# EAGLE design linesensor (EAGLE 6.4)
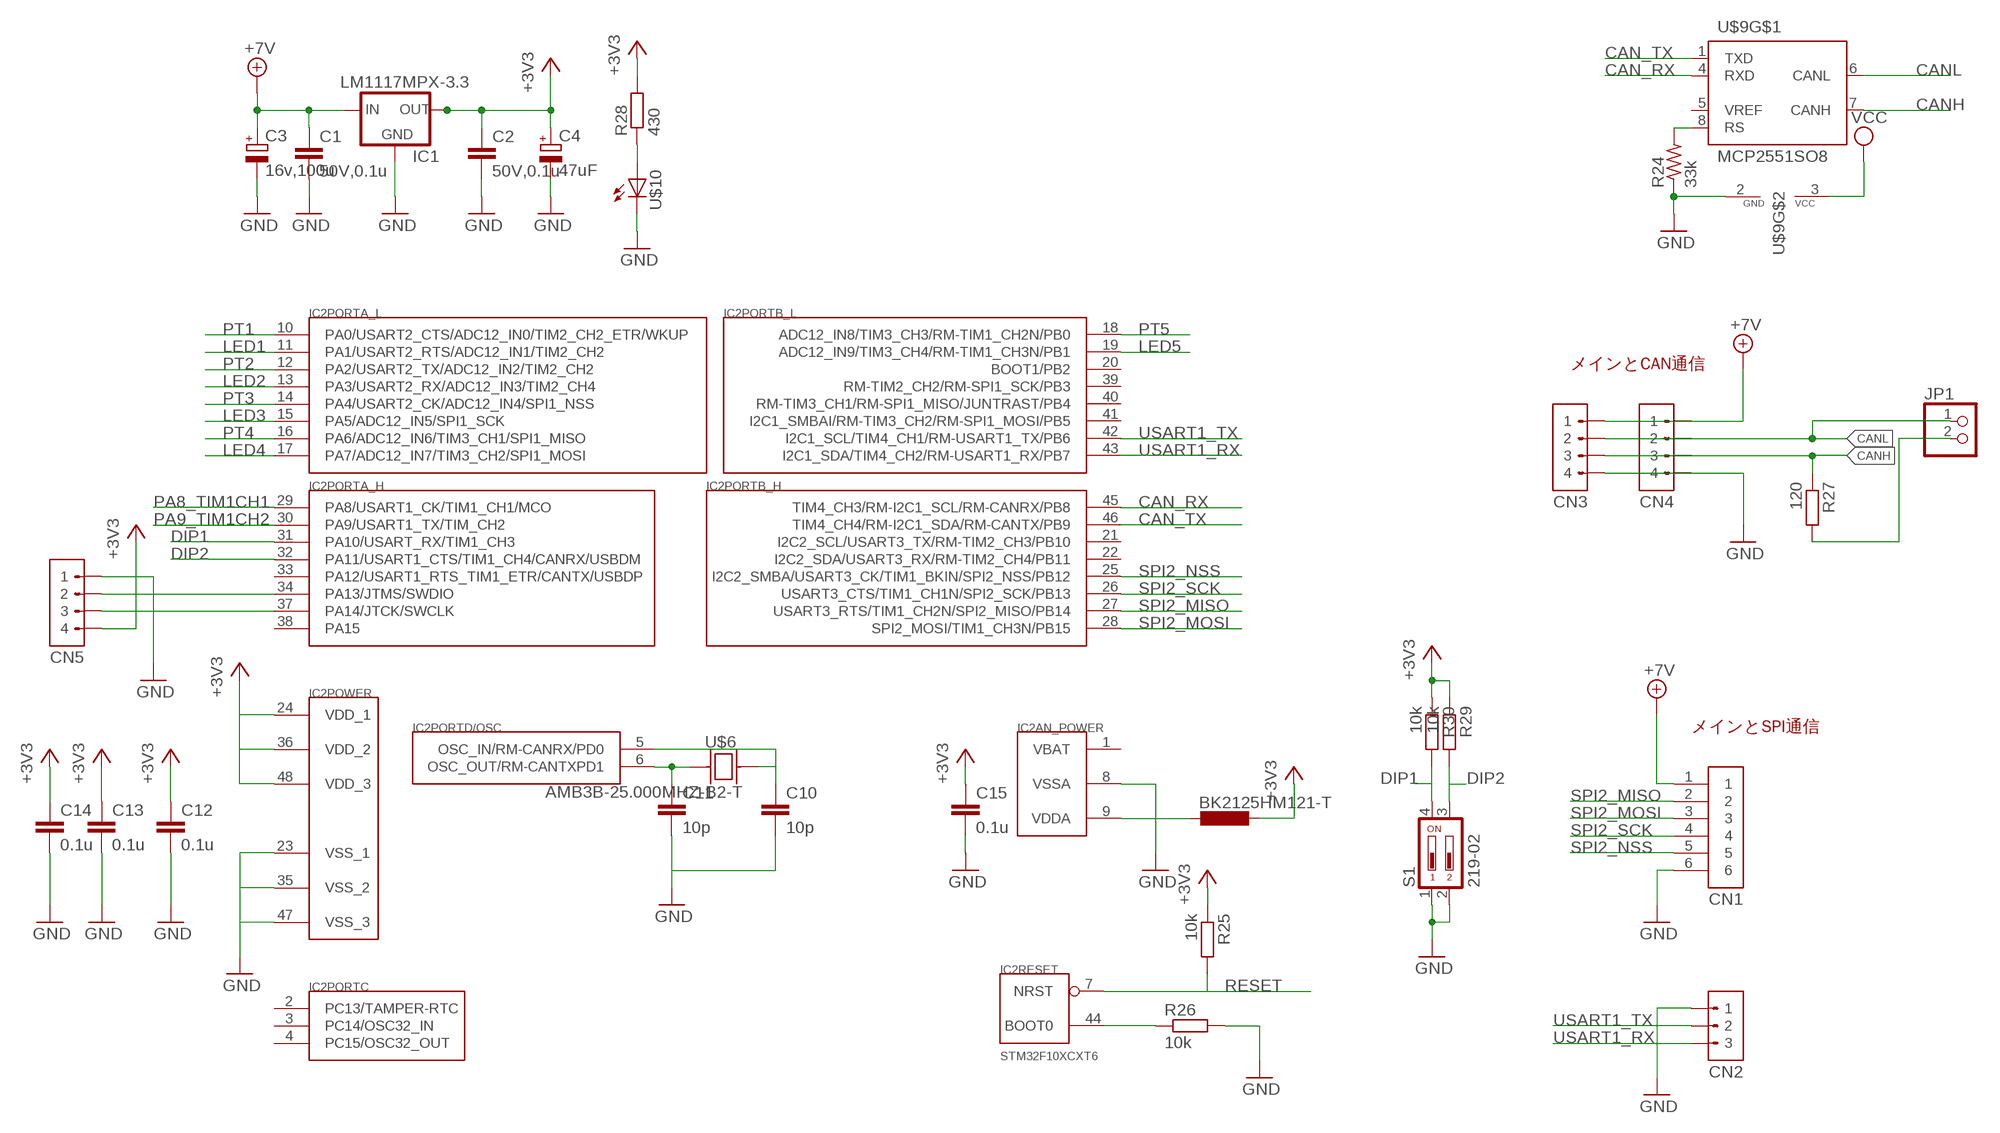
[diagram p0: schematic, sheet 1, part 1 of 2]
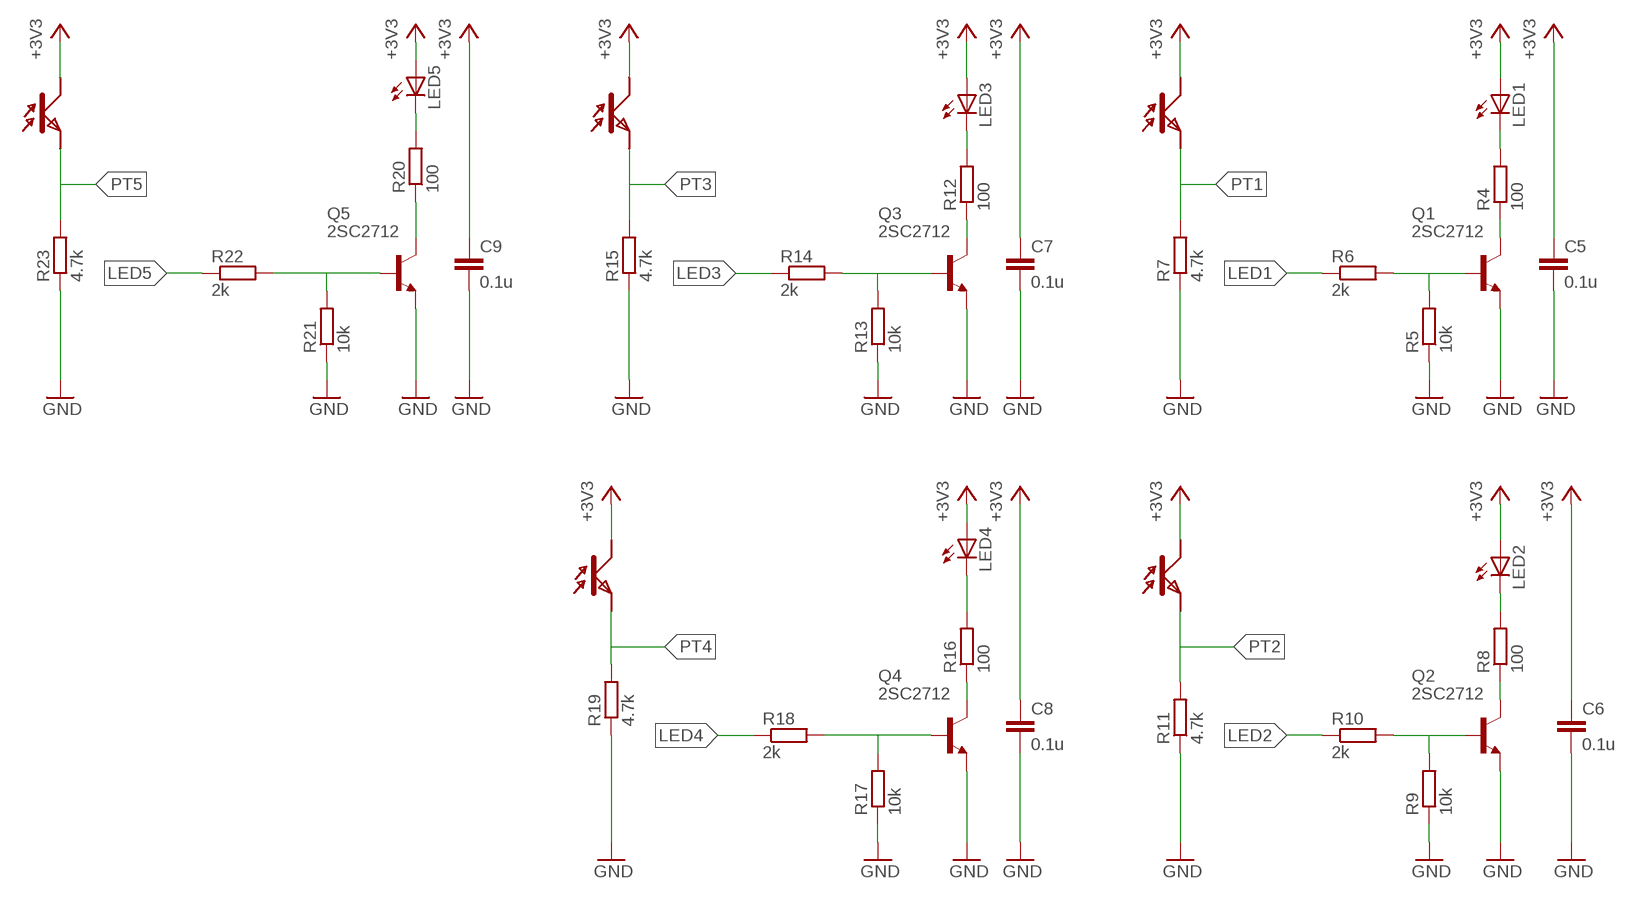
[diagram p1: schematic, sheet 1, part 2 of 2]

## Parts
BK2125HM121-T  L-EUL2012C  [L2012C]
C1  50V,0.1u  C-EUC0603K  [C0603K]
C2  50V,0.1u  C-EUC0603K  [C0603K]
C3  16v,100u  CPOL-EU153CLV-0605  [153CLV-0605]
C4  47uF  CPOL-EU153CLV-0405  [153CLV-0405]
C5  0.1u  C-EUC0603K  [C0603K]
C6  0.1u  C-EUC0603K  [C0603K]
C7  0.1u  C-EUC0603K  [C0603K]
C8  0.1u  C-EUC0603K  [C0603K]
C9  0.1u  C-EUC0603K  [C0603K]
C10  10p  C-EUC0603K  [C0603K]
C11  10p  C-EUC0603K  [C0603K]
C12  0.1u  C-EUC0603K  [C0603K]
C13  0.1u  C-EUC0603K  [C0603K]
C14  0.1u  C-EUC0603K  [C0603K]
C15  0.1u  C-EUC0603K  [C0603K]
CN1  CN6  [JST-B6B-XH-A]
CN2  TOP_TYPE_3PIN  [TOP_TYPE_3PIN]
CN3  CN4-JST-XH-TOP  [JST-B4B-XH-A]
CN4  CN4-JST-XH-TOP  [JST-B4B-XH-A]
CN5  TOP_TYPE_4PIN  [TOP_TYPE_4PIN]
IC1  LM1117MPX-3.3  LM1117  [SOT223]
IC2  STM32F10XCXT6  [TQFP48]
JP1  PINHD-1X2  [1X02]
LED1  LED3MM  [LED3MM]
LED2  LED3MM  [LED3MM]
LED3  LED3MM  [LED3MM]
LED4  LED3MM  [LED3MM]
LED5  LED3MM  [LED3MM]
Q1  2SC2712  [SC-59(TYPE1)]
Q2  2SC2712  [SC-59(TYPE1)]
Q3  2SC2712  [SC-59(TYPE1)]
Q4  2SC2712  [SC-59(TYPE1)]
Q5  2SC2712  [SC-59(TYPE1)]
R4  100  R-EU_R0603  [R0603]
R5  10k  R-EU_R0603  [R0603]
R6  2k  R-EU_R0603  [R0603]
R7  4.7k  R-EU_R0603  [R0603]
R8  100  R-EU_R0603  [R0603]
R9  10k  R-EU_R0603  [R0603]
R10  2k  R-EU_R0603  [R0603]
R11  4.7k  R-EU_R0603  [R0603]
R12  100  R-EU_R0603  [R0603]
R13  10k  R-EU_R0603  [R0603]
R14  2k  R-EU_R0603  [R0603]
R15  4.7k  R-EU_R0603  [R0603]
R16  100  R-EU_R0603  [R0603]
R17  10k  R-EU_R0603  [R0603]
R18  2k  R-EU_R0603  [R0603]
R19  4.7k  R-EU_R0603  [R0603]
R20  100  R-EU_R0603  [R0603]
R21  10k  R-EU_R0603  [R0603]
R22  2k  R-EU_R0603  [R0603]
R23  4.7k  R-EU_R0603  [R0603]
R24  33k  R-US_R0603  [R0603]
R25  10k  R-EU_R0603  [R0603]
R26  10k  R-EU_R0603  [R0603]
R27  120  R-EU_R0603  [R0603]
R28  430  R-EU_R0603  [R0603]
R29  10k  R-EU_R0603  [R0603]
R30  10k  R-EU_R0603  [R0603]
S1  219-02  [CTS-219-02]
U$1  SFH213  [SFH213]
U$2  SFH213  [SFH213]
U$3  SFH213  [SFH213]
U$4  SFH213  [SFH213]
U$5  SFH213  [SFH213]
U$6  AMB3B-25.000MHZ-B2-T  [4LCC]
U$9  MCP2551SO8  [SO08]
U$10  0603  [0603]

## Nets
+3V3: BK2125HM121-T.1 C2.1 C4.+ C5.1 C6.1 C7.1 C8.1 C9.1 C12.1 C13.1 C14.1 C15.1 CN5.4 IC1.2(OUT1) IC1.4(OUT) IC2.24(POWER:VDD_1) IC2.36(POWER:VDD_2) IC2.48(POWER:VDD_3) LED1.A LED2.A LED3.A LED4.A LED5.A R25.1 R28.2 R29.1 R30.1 U$1.P$1 U$2.P$1 U$3.P$1 U$4.P$1 U$5.P$1
+7V [VCC]: C1.1 C3.+ CN1.1 CN3.1 CN4.1 IC1.3(IN)
CAN_RX: IC2.45(PORTB_H:TIM4_CH3/RM-I2C1_SCL/RM-CANRX/PB8) U$9.4(RXD)
CAN_TX: IC2.46(PORTB_H:TIM4_CH4/RM-I2C1_SDA/RM-CANTX/PB9) U$9.1(TXD)
CANH: CN3.3 CN4.3 R27.1 U$9.7(CANH)
CANL: CN3.2 CN4.2 JP1.1 U$9.6(CANL)
DIP1: IC2.31(PORTA_H:PA10/USART_RX/TIM1_CH3) R30.2 S1.4
DIP2: IC2.32(PORTA_H:PA11/USART1_CTS/TIM1_CH4/CANRX/USBDM) R29.2 S1.3
GND: C1.2 C2.2 C3.- C4.- C5.2 C6.2 C7.2 C8.2 C9.2 C10.2 C11.2 C12.2 C13.2 C14.2 C15.2 CN1.6 CN2.1 CN3.4 CN4.4 CN5.1 IC1.1(GND) IC2.8(AN_POWER:VSSA) IC2.23(POWER:VSS_1) IC2.35(POWER:VSS_2) IC2.47(POWER:VSS_3) Q1.E Q2.E Q3.E Q4.E Q5.E R5.1 R7.1 R9.1 R11.1 R13.1 R15.1 R17.1 R19.1 R21.1 R23.1 R24.1 R26.2 S1.1 S1.2 U$9.2(GND) U$10.C
LED1: IC2.11(PORTA_L:PA1/USART2_RTS/ADC12_IN1/TIM2_CH2) R6.1
LED2: IC2.13(PORTA_L:PA3/USART2_RX/ADC12_IN3/TIM2_CH4) R10.1
LED3: IC2.15(PORTA_L:PA5/ADC12_IN5/SPI1_SCK) R14.1
LED4: IC2.17(PORTA_L:PA7/ADC12_IN7/TIM3_CH2/SPI1_MOSI) R18.1
LED5: IC2.19(PORTB_L:ADC12_IN9/TIM3_CH4/RM-TIM1_CH3N/PB1) R22.1
N$3: LED1.K(C) R4.2
N$4: Q1.C R4.1
N$6: Q1.B R5.2 R6.2
N$7: Q2.C R8.1
N$9: LED2.K(C) R8.2
N$10: Q2.B R9.2 R10.2
N$12: C10.1 IC2.5(PORTD/OSC:OSC_IN/RM-CANRX/PD0) U$6.3
N$13: Q3.B R13.2 R14.2
N$14: LED3.K(C) R12.2
N$15: Q3.C R12.1
N$16: C11.1 IC2.6(PORTD/OSC:OSC_OUT/RM-CANTXPD1) U$6.1
N$17: CN5.2 IC2.34(PORTA_H:PA13/JTMS/SWDIO)
N$18: LED4.K(C) R16.2
N$19: Q4.C R16.1
N$20: Q4.B R17.2 R18.2
N$22: CN5.3 IC2.37(PORTA_H:PA14/JTCK/SWCLK)
N$23: LED5.K(C) R20.2
N$24: Q5.C R20.1
N$25: Q5.B R21.2 R22.2
N$26: BK2125HM121-T.2 IC2.9(AN_POWER:VDDA)
N$27: IC2.44(RESET:BOOT0) R26.1
N$28: R24.2 U$9.8(RS)
N$29: JP1.2 R27.2
N$30: R28.1 U$10.A
PA8_TIM1CH1: IC2.29(PORTA_H:PA8/USART1_CK/TIM1_CH1/MCO)
PA9_TIM1CH2: IC2.30(PORTA_H:PA9/USART1_TX/TIM_CH2)
PT1: IC2.10(PORTA_L:PA0/USART2_CTS/ADC12_IN0/TIM2_CH2_ETR/WKUP) R7.2 U$1.P$2
PT2: IC2.12(PORTA_L:PA2/USART2_TX/ADC12_IN2/TIM2_CH2) R11.2 U$2.P$2
PT3: IC2.14(PORTA_L:PA4/USART2_CK/ADC12_IN4/SPI1_NSS) R15.2 U$3.P$2
PT4: IC2.16(PORTA_L:PA6/ADC12_IN6/TIM3_CH1/SPI1_MISO) R19.2 U$4.P$2
PT5: IC2.18(PORTB_L:ADC12_IN8/TIM3_CH3/RM-TIM1_CH2N/PB0) R23.2 U$5.P$2
RESET: IC2.7(RESET:NRST) R25.2
SPI2_MISO: CN1.2 IC2.27(PORTB_H:USART3_RTS/TIM1_CH2N/SPI2_MISO/PB14)
SPI2_MOSI: CN1.3 IC2.28(PORTB_H:SPI2_MOSI/TIM1_CH3N/PB15)
SPI2_NSS: CN1.5 IC2.25(PORTB_H:I2C2_SMBA/USART3_CK/TIM1_BKIN/SPI2_NSS/PB12)
SPI2_SCK: CN1.4 IC2.26(PORTB_H:USART3_CTS/TIM1_CH1N/SPI2_SCK/PB13)
USART1_RX: CN2.3 IC2.43(PORTB_L:I2C1_SDA/TIM4_CH2/RM-USART1_RX/PB7)
USART1_TX: CN2.2 IC2.42(PORTB_L:I2C1_SCL/TIM4_CH1/RM-USART1_TX/PB6)
VCC: U$9.3(VCC)
Unconnected: IC2.2(PORTC:PC13/TAMPER-RTC) IC2.3(PORTC:PC14/OSC32_IN) IC2.4(PORTC:PC15/OSC32_OUT) IC2.20(PORTB_L:BOOT1/PB2) IC2.21(PORTB_H:I2C2_SCL/USART3_TX/RM-TIM2_CH3/PB10) IC2.22(PORTB_H:I2C2_SDA/USART3_RX/RM-TIM2_CH4/PB11) IC2.33(PORTA_H:PA12/USART1_RTS_TIM1_ETR/CANTX/USBDP) IC2.38(PORTA_H:PA15) IC2.39(PORTB_L:RM-TIM2_CH2/RM-SPI1_SCK/PB3) IC2.40(PORTB_L:RM-TIM3_CH1/RM-SPI1_MISO/JUNTRAST/PB4) IC2.41(PORTB_L:I2C1_SMBAI/RM-TIM3_CH2/RM-SPI1_MOSI/PB5) U$6.2(G1) U$6.4(G2) U$9.5(VREF)

## Notes on the sheet
- メインとCAN通信
- メインとSPI通信

## Power pins joined to a net without a drawn wire
VBAT: IC2.1(AN_POWER:VBAT)

## Library data of the parts
BK2125HM121-T = resistor:L-EU: INDUCTOR, European symbol
C1 C2 C5-C15 = resistor:C-EU: CAPACITOR, European symbol
C3 C4 = rcl:CPOL-EU: POLARIZED CAPACITOR, European symbol
CN1 = con-jst_xh:CN6
CN2 = GHconnector_2:TOP_TYPE_3PIN
CN3 CN4 = con-jst_xh:CN4: Connector 4 circuits
CN5 = GHconnector_2:TOP_TYPE_4PIN
IC1 = VoltageRegulator:LM1117
IC2 = stm32:STM32F10XCXT6: ST STM32F101/103 48pin LQFP
JP1 = pinhead:PINHD-1X2: PIN HEADER
LED1-LED5 = led:LED: LED OSRAM: - CHIPLED LG R971, LG N971, LY N971, LG Q971, LY Q971, LO R971, LY R971 LH N974, LH R974 LS Q976, LO Q976, LY Q976 LO Q996 - Hyper CHIPLED LW Q18S LB Q993, LB Q99A, LB R99A - SideLED LS A670, LO A670, LY A670, LG A670, LP A670 LB A673, LV A673, LT A673, LW A673 LH A674 LY A675 LS A676, LA A676, LO A676, LY A676, LW A676 LS A679, LY A679, LG A679 - Hyper Micro SIDELED® LS Y876, LA Y876, LO Y876, LY Y876 LT Y87S - SmartLED LW L88C, LW L88S LB L89C, LB L89S, LG L890 LS L89K, LO L89K, LY L89K LS L896, LA L896, LO L896, LY L896 - TOPLED LS T670, LO T670, LY T670, LG T670, LP T670 LSG T670, LSP T670, LSY T670, LOP T670, LYG T670 LG T671, LOG T671, LSG T671 LB T673, LV T673, LT T673, LW T673 LH T674 LS T676, LA T676, LO T676, LY T676, LB T676, LH T676, LSB T676, LW T676 LB T67C, LV T67C, LT T67C, LS T67K, LO T67K, LY T67K, LW E67C LS E67B, LA E67B, LO E67B, LY E67B, LB E67C, LV E67C, LT E67C LW T67C LS T679, LY T679, LG T679 LS T770, LO T770, LY T770, LG T770, LP T770 LB T773, LV T773, LT T773, LW T773 LH T774 LS E675, LA E675, LY E675, LS T675 LS T776, LA T776, LO T776, LY T776, LB T776 LHGB T686 LT T68C, LB T68C - Hyper Mini TOPLED® LB M676 - Mini TOPLED Santana® LG M470 LS M47K, LO M47K, LY M47K Source: http://www.osram.convergy.de LUXEON: - LUMILED® LXK2-PW12-R00, LXK2-PW12-S00, LXK2-PW14-U00, LXK2-PW14-V00 LXK2-PM12-R00, LXK2-PM12-S00, LXK2-PM14-U00 LXK2-PE12-Q00, LXK2-PE12-R00, LXK2-PE12-S00, LXK2-PE14-T00, LXK2-PE14-U00 LXK2-PB12-K00, LXK2-PB12-L00, LXK2-PB12-M00, LXK2-PB14-N00, LXK2-PB14-P00, LXK2-PB14-Q00 LXK2-PR12-L00, LXK2-PR12-M00, LXK2-PR14-Q00, LXK2-PR14-R00 LXK2-PD12-Q00, LXK2-PD12-R00, LXK2-PD12-S00 LXK2-PH12-R00, LXK2-PH12-S00 LXK2-PL12-P00, LXK2-PL12-Q00, LXK2-PL12-R00 Source: www.luxeon.com KINGBRIGHT: KA-3528ASYC Source: www.kingbright.com
Q1-Q5 = Transistor:2SC2712
R4-R23 R25-R30 = resistor:R-EU_: RESISTOR, European symbol
R24 = resistor:R-US_: RESISTOR, American symbol
S1 = switch-dil:219-02*: Surface Mount DIP Switch Series 219 SMT CTS Electronic Components Sourc: www.ctscorp.com; OC_FARNELL: unknown; OC_NEWARK: unknown
U$1-U$5 = sfh213:SFH213
U$6 = stm32f4:AMB3B-25.000MHZ-B2-T: CRYSTAL, 25.000MHZ 18PF SMD reviewed: YES tested: YES
U$9 = can:MCP2551: CAN Tranceiver Microchip
U$10 = led_0603:0603

## Board
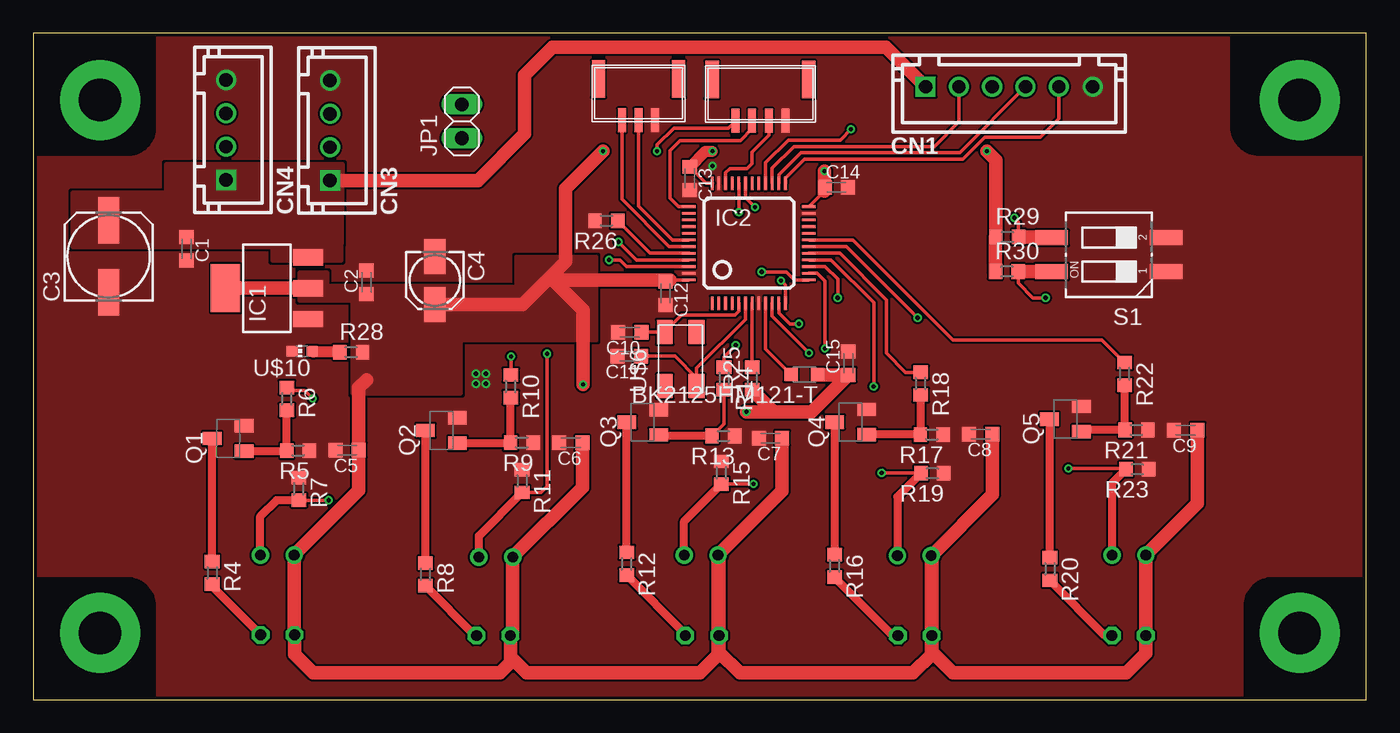
[diagram p2: board, top side]
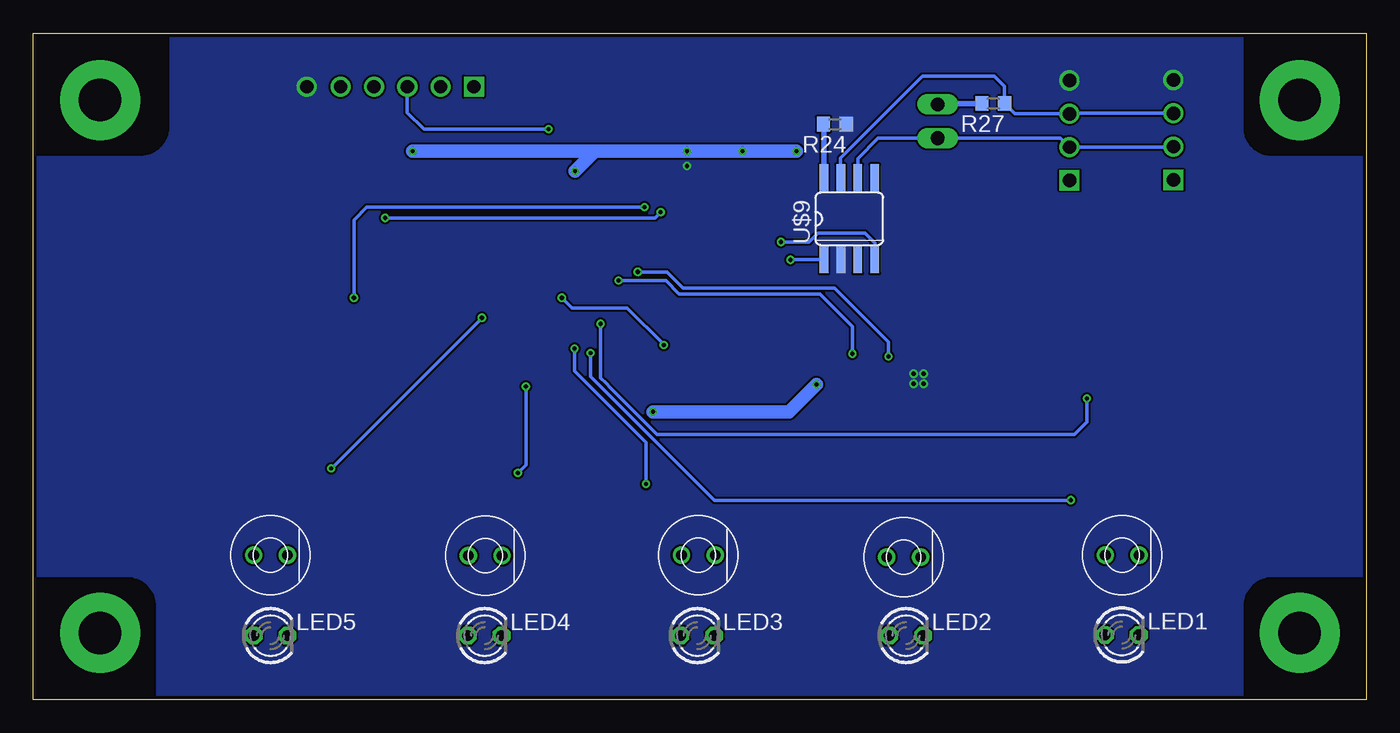
[diagram p3: board, bottom side, seen from below]

Size 100 x 50 mm. Coordinates in mm from the lower left corner, seen from the top.
Outline: 0,0 100,0 100,50 0,50 0,0
Copper layers (1*16): Top 0.035mm / dielectric 1.5mm / Bottom 0.035mm
Design rules "Elecrow_2-layer_eagle_rule": minimum track width 6mil, minimum drill 12mil, track to track 6mil, track to pad 6mil, pad to pad 6mil, via to via 6mil, smd to smd 0mil, copper to edge 10mil, drill to drill 10mil, minimum pad ring 10mil, minimum via ring 6mil, stop-mask expansion 2mil, vias tented up to drill 100mil, thermal gap 10mil
tRestrict: 12 lines
bRestrict: 12 lines

### Footprints (pad centres in the part's own frame; a part is rotated, then mirrored left to right if it is on the bottom)
L2012C = smd 1 x 1: 1 -1,0; 2 1,0
C0603K = smd 1.05 x 1.08: 1 -0.875,0; 2 0.875,0
153CLV-0605 = smd 3.5 x 1.6: + 2.7,0; - -2.7,0
153CLV-0405 = smd 2.6 x 1.6: + 1.8,0; - -1.8,0
JST-B6B-XH-A = drill 1 square: 1 0.08,0 | drill 1: 2 2.58,0; 3 5.08,0; 4 7.58,0; 5 10.08,0; 6 12.62,0
TOP_TYPE_3PIN = smd 0.6 x 1.8: 1 -1.25,2.025; 2 0,2.025; 3 1.25,2.025 | smd 1 x 2.8: P$4 -3,-1.075; P$5 3,-1.075
JST-B4B-XH-A = drill 1 square: 1 -3.75,0 | drill 1: 2 -1.25,0; 3 1.25,0; 4 3.75,0
TOP_TYPE_4PIN = smd 0.6 x 1.8: 1 -1.875,2.025; 2 -0.625,2.025; 3 0.625,2.025; 4 1.875,2.025 | smd 1 x 2.8: P$1 -3.625,-1.075; P$2 3.625,-1.075
SOT223 = smd 1.219 x 2.235: 1 -2.311,-3.099; 2 0,-3.099; 3 2.311,-3.099 | smd 3.6 x 2.2: 4 0,3.099
TQFP48 = smd 0.2 x 1: 1 -2.75,-4.5; 2 -2.25,-4.5; 3 -1.75,-4.5; 4 -1.25,-4.5; 5 -0.75,-4.5; 6 -0.25,-4.5; 7 0.25,-4.5; 8 0.75,-4.5; 9 1.25,-4.5; 10 1.75,-4.5; 11 2.25,-4.5; 12 2.75,-4.5; 25 2.75,4.5; 26 2.25,4.5; 27 1.75,4.5; 28 1.25,4.5; 29 0.75,4.5; 30 0.25,4.5; 31 -0.25,4.5; 32 -0.75,4.5; 33 -1.25,4.5; 34 -1.75,4.5; 35 -2.25,4.5; 36 -2.75,4.5 | smd 1 x 0.2: 13 4.5,-2.75; 14 4.5,-2.25; 15 4.5,-1.75; 16 4.5,-1.25; 17 4.5,-0.75; 18 4.5,-0.25; 19 4.5,0.25; 20 4.5,0.75; 21 4.5,1.25; 22 4.5,1.75; 23 4.5,2.25; 24 4.5,2.75; 37 -4.5,2.75; 38 -4.5,2.25; 39 -4.5,1.75; 40 -4.5,1.25; 41 -4.5,0.75; 42 -4.5,0.25; 43 -4.5,-0.25; 44 -4.5,-0.75; 45 -4.5,-1.25; 46 -4.5,-1.75; 47 -4.5,-2.25; 48 -4.5,-2.75
1X02 = drill 1.016 long: 1 -1.27,0; 2 1.27,0
LED3MM = drill 0.813 octagon: A -1.27,0; K 1.27,0
SC-59(TYPE1) = smd 1 x 1.4: B -0.95,-1.2; C 0,1.2; E 0.95,-1.2
R0603 = smd 1 x 1.1: 1 -0.85,0; 2 0.85,0
CTS-219-02 = smd 1.13 x 2.44: 1 -1.27,-4.3; 2 1.27,-4.3; 3 1.27,4.3; 4 -1.27,4.3
SFH213 = drill 0.8: P$1 0,1.27; P$2 0,-1.27
4LCC = smd 1.803 x 1.194: 1 -2.032,-1.194; 2 2.032,-1.194; 3 2.032,1.194; 4 -2.032,1.194
SO08 = smd 0.66 x 2.032: 1 -1.905,-3.073; 2 -0.635,-3.073; 3 0.635,-3.073; 4 1.905,-3.073; 5 1.905,3.073; 6 0.635,3.073; 7 -0.635,3.073; 8 -1.905,3.073
0603 = smd 0.8 x 0.8: A 0,-0.75; C 0,0.75

### Placement (x,y rotation side)
BK2125HM121-T  57.85,24.39 180 top
C1  11.5,33.82 270 top
C2  25,31.31 90 top
C3  5.65,33.26 90 top
C4  30.13,31.45 270 top
C5  23.54,18.72 180 top
C6  40.32,19.27 180 top
C7  55.3,19.62 180 top
C8  71.08,19.92 180 top
C9  86.46,20.22 180 top
C10  44.75,27.57 180 top
C11  44.71,25.77 180 top
C12  47.43,30.49 270 top
C13  49.25,39.1 270 top
C14  60.25,38.45 0 top
C15  61.15,25.25 90 top
CN1  66.86,45.99 0 top
CN2  45.4,45.5 180 top
CN3  22.26,42.71 90 top
CN4  14.46,42.75 90 top
CN5  54.55,45.45 180 top
IC1  17.52,30.87 90 top
IC2  53.68,34.25 0 top
JP1  32.15,43.4 90 top
LED1  18.33,4.85 0 bottom
LED2  34.52,4.8 0 bottom
LED3  50.18,4.8 0 bottom
LED4  66.14,4.8 0 bottom
LED5  82.2,4.8 0 bottom
Q1  14.62,19.59 90 top
Q2  30.62,20.2 90 top
Q3  45.72,20.81 90 top
Q4  61.32,20.82 90 top
Q5  77.43,21.05 90 top
R4  13.42,9.51 270 top
R5  19.87,18.68 180 top
R6  19.02,22.56 270 top
R7  19.92,15.81 270 top
R8  29.42,9.39 270 top
R9  36.65,19.28 180 top
R10  35.82,23.51 270 top
R11  36.67,16.39 270 top
R12  44.52,10.19 270 top
R13  51.77,19.78 180 top
R14  51.82,24.1 270 top
R15  51.62,17.02 270 top
R16  60.12,10.03 270 top
R17  67.41,19.88 180 top
R18  66.57,23.71 270 top
R19  67.45,16.98 180 top
R20  76.27,9.79 270 top
R21  82.77,20.23 180 top
R22  81.87,24.45 270 top
R23  82.83,17.28 180 top
R24  39.87,43.18 180 bottom
R25  53.93,24.09 90 top
R26  42.99,35.93 180 top
R27  27.98,44.73 180 bottom
R28  23.85,26.07 0 top
R29  73.07,34.72 0 top
R30  73.04,32.12 0 top
S1  80.7,33.39 90 top
U$1  18.3,10.85 90 bottom
U$2  34.7,10.7 90 bottom
U$3  50.1,10.85 90 bottom
U$4  66.1,10.8 90 bottom
U$5  82.2,10.85 90 bottom
U$6  48.57,25.55 90 top
U$9  38.78,36.08 0 bottom
U$10  20.17,26.15 90 top

### Tracks (layer width: path | path; a pad name or v marks a point on that pad's centre or on a via)
+3V3  (via drill 0.31)
  Top 0.254: 56.43,19.25 56.17,19 | 87,20 87,20.15 87.07,20.22 C9.1 | IC2.48 47.75,31.5 | 50.95,38.77 IC2.36 50.48,38.75 C13.1 | CN5.4 52.15,42.9 48.05,42.9 46.8,41.65 v46.8,41.15 | C12.1 47.3,31.5 47,31.5 | C14.1 59.38,38.2 59.35,38.17 IC2.24 | 58.87,24.38 BK2125HM121-T.1 | C7.1 56.4,19.62
  Top 0.406: 39.4,31.59 39.4,31.5
  Top 0.813: C13.1 50.42,41.15 v50.95,41.15
  Top 1.016: C7.1 56.17,19 56.17,15.65 U$3.P$1 | U$3.P$1 51.45,10.77 LED3.A 51.45,3.55 53,2 66,2 67.37,3.37 U$4.P$1 | U$4.P$1 67.41,10.76 LED4.A 67.41,3.59 69,2 82,2 83.47,3.47 U$5.P$1 | U$5.P$1 LED5.A | U$3.P$1 51.37,3.37 50,2 37,2 35.79,3.21 | 35.79,3.21 LED2.A 35.97,4.98 U$2.P$1 41.2,15.93 C6.1 | 35.79,3.21 35.79,2.79 35,2 21,2 19.6,3.4 LED1.A 19.57,4.88 U$1.P$1 24.41,15.7 C5.1 24.41,23.41 25,24 | IC1.2 IC1.4 | 38.55,31.5 39,31.5 | 39,31.5 39.4,31.5 47,31.5 47.75,31.5 | C4.+ 36.7,29.65 38.55,31.5 | v42.75,41.15 39.92,38.33 39.92,32.88 38.55,31.5 | R30.1 72.19,34.69 R29.1 72.22,40.48 v71.55,41.15 | 59.35,38.17 v59.35,39.65 | U$5.P$1 87.33,14.71 C9.1 | U$4.P$1 71.95,15.38 C8.1 | 55.57,21.6 v53.5,21.6 | v41.25,23.65 41.25,29.25 39,31.5 | R25.1 55.57,21.6 | 55.57,21.6 58.38,21.6 C15.1 58.87,24.38
  Bottom 1.016: v71.55,41.15 57.85,41.15 | 57.85,41.15 v50.95,41.15 v46.8,41.15 v42.75,41.15 | v59.35,39.65 57.85,41.15 | v53.5,21.6 43.3,21.6 v41.25,23.65
  pour Top (no thermals): 20,32 20,30 24,30 24,23 32,23 32,31 22,31 22,32
  pour Top: 31.85,31 36.2,31 36.2,33.25 42.25,33.25 42.25,26.95 31.8,26.95
+7V
  Top 1.016: CN1.1 63.98,48.95 38.95,48.95 36.85,46.85 36.85,42.45 33.36,38.96 CN3.1
  pour Top (no thermals): 23.15,40.15 10,40.15 10,38 3,38 3,34 18,34 18,33 23.05,33
CAN_RX  (via drill 0.31)
  Top 0.254: IC2.45 45.25,33 v43.9,34.35
  Bottom 0.254: U$9.4 36.88,34.27 37.6,35 41.15,35 41.8,34.35 v43.9,34.35
CAN_TX  (via drill 0.31)
  Top 0.254: IC2.46 44.5,32.5 44,33 v43.2,33
  Bottom 0.254: U$9.1 v43.19,33.01 v43.2,33
CANH
  Bottom 0.254: 39.45,39.12 39.45,40.65 33.3,46.8 27.9,46.8 27.15,46.05 27.15,44.75 R27.1 26.36,43.96 CN3.3 22.26,44 CN4.3
  Bottom 0.406: 27.13,44.71 R27.1 | 39.45,39.12 U$9.7
CANL
  Bottom 0.254: CN4.2 14.5,41.46 CN3.2 22.93,42.13 JP1.1 36.62,42.13 38.15,40.6 U$9.6
DIP1  (via drill 0.31)
  Top 0.254: IC2.31 53.43,37.67 v54.15,36.95 | v75.95,30.15 75,30.15 73.9,31.25 R30.2
  Top 1.016: S1.4 R30.2
  Bottom 0.254: v54.15,36.95 75,36.95 75.95,36 v75.95,30.15
DIP2  (via drill 0.31)
  Top 0.254: IC2.32 v52.93,36.57 | 74.05,34.85 R29.2 73.92,35.83 v73.6,36.15
  Top 1.016: R29.2 76.34,34.72 S1.3
  Bottom 0.254: v73.6,36.15 53.35,36.15 v52.93,36.57
GND  (via drill 0.31)
  other vias: 33.2,23.7 33.95,24.45 33.95,23.7 33.2,24.45 50.95,40.05
  pour Bottom (rank 6, no thermals): -1.85,51.85 -2,-3 106,-3 106.15,51.85
  pour Top (rank 6, no thermals): 0,50 0,-2 104.7,-1.7 104.7,50.3
LED1  (via drill 0.31)
  Top 0.254: R6.1 19.23,23.2 20.35,23.2 v20.95,22.6 | IC2.11 55.93,29.02 56.75,28.2 v57.45,28.2
  Bottom 0.254: v20.95,22.6 20.95,20.85 21.9,19.9 53.2,19.9 56.7,23.4 57.05,23.75 57.45,24.15 v57.45,28.2
LED2  (via drill 0.31)
  Top 0.254: IC2.13 57.1,31.5 56.5,32.1 v54.65,32.1 | R10.1 35.85,24.39 v35.85,25.75
  Bottom 0.254: v54.65,32.1 52.45,32.1 51.25,30.9 39.9,30.9 35.85,26.85 v35.85,25.75
LED3  (via drill 0.31)
  Top 0.254: IC2.15 59.4,32.5 60.35,31.55 v60.35,30.15 | R14.1 51.82,25.72 v52.7,26.6
  Bottom 0.254: v60.35,30.15 59.6,29.4 55.45,29.4 52.7,26.65 v52.7,26.6
LED4
  Top 0.254: IC2.17 60.5,33.5 64,30 64,26 65.44,24.56 R18.1
LED5
  Top 0.254: IC2.19 61.5,34.5 69,27 80.17,27 R22.1
N$1  (via drill 3.2 pad 6)
  other vias: 95,45
N$2  (via drill 3.2 pad 6)
  other vias: 5,45
N$3
  Top 0.61: LED1.K 13.42,8.49 R4.2
N$4
  Top 0.61: R4.1 Q1.C
N$5  (via drill 3.2 pad 6)
  other vias: 5,5
N$6
  Top 0.61: Q1.B 18.98,18.64 R5.2 R6.2
N$7
  Top 0.61: R8.1 Q2.C
N$8  (via drill 3.2 pad 6)
  other vias: 95,5
N$9
  Top 0.61: LED2.K 33.16,4.8 R8.2
N$10
  Top 0.61: Q2.B 35.77,19.25 R9.2 35.8,22.64 R10.2
N$12
  Top 0.254: U$6.3 47.38,27.88 | U$6.3 47.36,27.57 C10.1 | U$6.3 48.64,28.85 52.65,28.85 52.95,29.15 52.95,29.73 IC2.5
N$13
  Top 0.254: R13.2 51.82,20.68 R14.2
  Top 0.61: R13.2 47,19.78 Q3.B
N$14
  Top 0.61: LED3.K 48.91,4.95 R12.2
N$15
  Top 0.61: R12.1 Q3.C
N$16
  Top 0.254: C11.1 48.14,25.77 49.76,24.15 | 49.76,24.15 U$6.1 | 49.76,24.15 49.76,24.86 53.43,28.53 IC2.6
N$17
  Top 0.254: CN5.2 55.17,42.38 53.9,41.1 53.9,40.2 53.55,39.85 52.25,39.85 51.93,39.53 IC2.34
N$18
  Top 0.61: LED4.K 64.5,4.8 R16.2
N$19
  Top 0.61: Q4.C R16.1
N$20
  Top 0.61: R18.2 R17.2 Q4.B
N$22
  Top 0.254: IC2.37 48.4,37 47.75,37.65 47.75,41.2 48.5,41.95 53.05,41.95 53.92,42.83 CN5.3
N$23
  Top 0.61: LED5.K 80.41,4.8 R20.2
N$24
  Top 0.61: R20.1 76.27,21.01 Q5.C
N$25
  Top 0.61: Q5.B 78.76,20.23 R21.2 81.87,20.28 R22.2
N$26
  Top 0.254: IC2.9 54.93,26.31 BK2125HM121-T.2
N$27
  Top 0.254: IC2.44 46.27,33.5 R26.1
N$28
  Bottom 0.406: U$9.8 40.69,43.15 R24.2
N$29
  Bottom 0.406: R27.2 32.15,44.73 JP1.2
N$30
  Top 0.813: R28.1 21,26.07 U$10.A
PT1  (via drill 0.31)
  Top 0.254: R7.2 v22.16,14.96 | v58.2,26 55.43,28.77 IC2.10
  Top 0.61: U$1.P$2 17.03,13.75 18.24,14.96 R7.2
  Bottom 0.254: v22.16,14.96 48.91,14.96 58.2,24.25 v58.2,26
PT2  (via drill 0.31)
  Top 0.254: 36.71,15.5 R11.2 38.09,15.54 38.55,16 v38.55,25.95 | IC2.12 56.43,31.12 v56.1,31.45
  Top 0.61: U$2.P$2 33.43,12.3 R11.2
  Bottom 0.254: v56.1,31.45 52.55,31.45 51.55,30.45 41,30.45 38.55,28 v38.55,25.95
PT3  (via drill 0.31)
  Top 0.254: R15.2 v54.03,16.17 | IC2.14 58.8,32 59.4,31.4 v59.4,26.35
  Top 0.61: U$3.P$2 48.83,13.38 R15.2
  Bottom 0.254: v54.03,16.17 54.03,19.28 59.4,24.65 v59.4,26.35
PT4  (via drill 0.31)
  Top 0.254: IC2.16 59.85,33 63.05,29.8 v63.05,23.5 | v63.65,17 66.58,17 R19.2
  Top 0.61: R19.2 64.83,15.21 U$4.P$2
  Bottom 0.254: v63.05,23.5 63.05,17.6 v63.65,17
PT5  (via drill 0.31)
  Top 0.254: IC2.18 61,34 v66.35,28.65 | R23.2 81.91,17.35 v77.65,17.35
  Top 0.61: R23.2 80.93,16.23 U$5.P$2
  Bottom 0.254: v66.35,28.65 77.3,17.7 v77.65,17.35
RESET
  Top 0.254: R25.2 IC2.7
SPI2_MISO
  Top 0.254: IC2.27 55.43,39.88 57.05,41.5 67.6,41.5 69.45,43.35 CN1.2
SPI2_MOSI  (via drill 0.31)
  Top 0.254: IC2.28 54.93,40.28 56.65,42 60.55,42 v61.35,42.8
  Bottom 0.254: v61.35,42.8 70.7,42.8 71.95,44.05 CN1.3
SPI2_NSS
  Top 0.254: IC2.25 56.43,39.13 57.85,40.55 69.75,40.55 71.4,42.2 75.55,42.2 76.94,43.59 CN1.5
SPI2_SCK
  Top 0.254: IC2.26 55.93,39.38 57.6,41.05 69.5,41.05 CN1.4
USART1_RX
  Top 0.254: IC2.43 47.7,34 44.15,37.55 CN2.3
USART1_TX
  Top 0.254: IC2.42 47.95,34.5 45.4,37.05 CN2.2